# EAGLE schematic schematic (EAGLE 9.6.2)
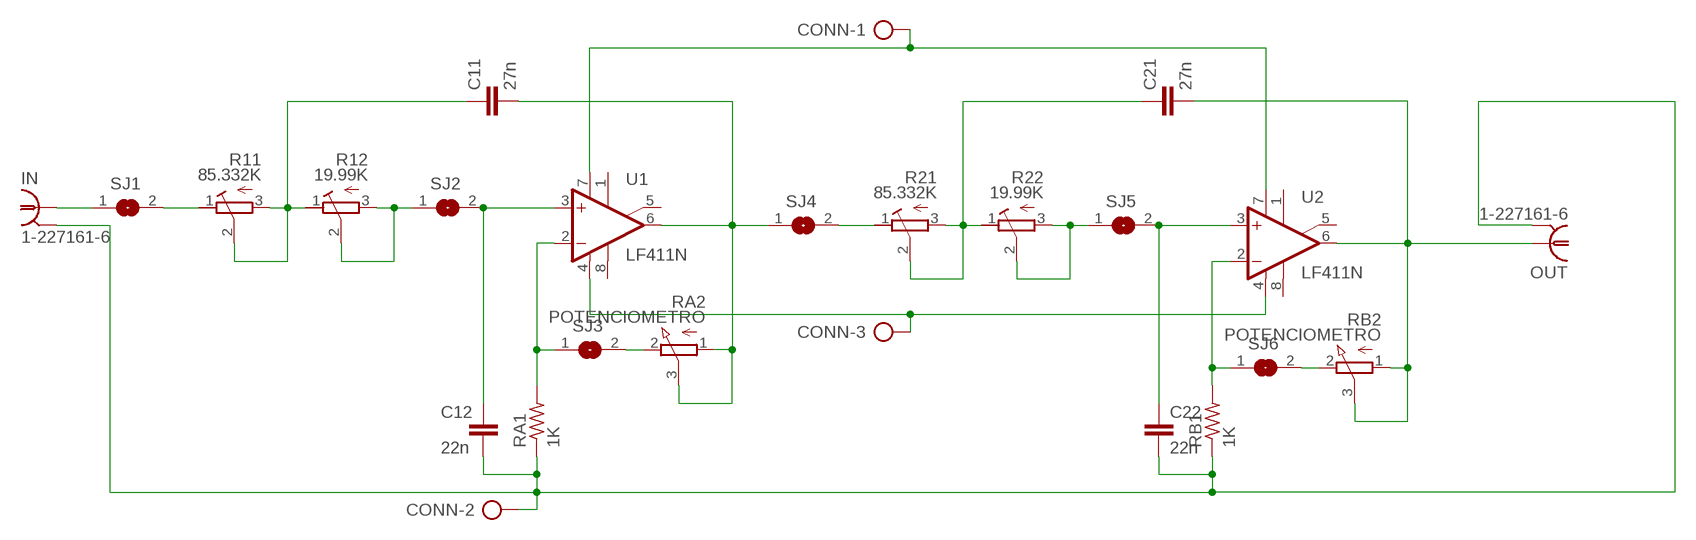
[diagram p0: schematic, sheet 1]

## Parts
C11  27n  C-EU050-025X075  [C050-025X075]
C12  22n  C-EU050-025X075  [C050-025X075]
C21  27n  C-EU050-025X075  [C050-025X075]
C22  22n  C-EU050-025X075  [C050-025X075]
CONN  AK500/3  [AK500/3]
IN  1-227161-6  [AMP_227161]
OUT  1-227161-6  [AMP_227161]
R11  85.332K  R-TRIMMT93YB  [RTRIMT93YB]
R12  19.99K  R-TRIMMT93YB  [RTRIMT93YB]
R21  85.332K  R-TRIMMT93YB  [RTRIMT93YB]
R22  19.99K  R-TRIMMT93YB  [RTRIMT93YB]
RA1  1K  R-US_0207/10  [0207/10]
RA2  POTENCIOMETRO  [TSM4YJ]
RB1  1K  R-US_0207/10  [0207/10]
RB2  POTENCIOMETRO  [TSM4YJ]
SJ1  SJW  [SJW]
SJ2  SJW  [SJW]
SJ3  SJW  [SJW]
SJ4  SJW  [SJW]
SJ5  SJW  [SJW]
SJ6  SJW  [SJW]
U1  LF411N  [DIL08]
U2  LF411N  [DIL08]

## Nets
N$1: IN.1 SJ1.1
N$2: R11.1(E) SJ1.2
N$3: C11.1 R11.2(S) R11.3(A) R12.1(E)
N$4: R12.2(S) R12.3(A) SJ2.1
N$5: C12.1 SJ2.2 U1.3(+IN)
N$6: RA1.2 SJ3.1 U1.2(-IN)
N$7: C12.2 C22.2 CONN.2 IN.2 OUT.2 RA1.1 RB1.1
N$8: C11.2 RA2.1(A) RA2.3(S) SJ4.1 U1.6(OUT)
N$9: R21.1(E) SJ4.2
N$10: RA2.2(E) SJ3.2
N$11: C21.1 R21.2(S) R21.3(A) R22.1(E)
N$12: R22.2(S) R22.3(A) SJ5.1
N$13: C22.1 SJ5.2 U2.3(+IN)
N$14: C21.2 OUT.1 RB2.1(A) RB2.3(S) U2.6(OUT)
N$16: RB1.2 SJ6.1 U2.2(-IN)
N$17: RB2.2(E) SJ6.2
N$18: CONN.1 U1.7(V+) U2.7(V+)
N$19: CONN.3 U1.4(V-) U2.4(V-)
Unconnected: U1.1(ON1) U1.5(ON2) U1.8(OPT) U2.1(ON1) U2.5(ON2) U2.8(OPT)

## Library data of the parts
C11 C12 C21 C22 = rcl:C-EU: CAPACITOR, European symbol; SPICEPREFIX: C
CONN = con-ptr500:AK500/3: CONNECTOR; OC_FARNELL: unknown; OC_NEWARK: unknown
IN OUT = con-coax:?227161*: JACK, RIGHT ANGLE, 50 OHM, PCB, BNC Source: amp_227161.pdf; MF: TYCO ELECTRONICS; MPN: 1-227161-6; OC_FARNELL: unknown; OC_NEWARK: 09H7854
R11 R12 R21 R22 = rcl:R-TRIMM: Trimm resistor; SPICEMODEL: X; SPICEPREFIXL: POT
RA1 RB1 = rcl:R-US_: RESISTOR, American symbol; SPICEPREFIX: R
RA2 RB2 = TSM4_Vishay:POTENCIOMETRO
SJ1-SJ6 = jumper:SJ: SMD solder JUMPER
U1 U2 = linear:LF411: OP AMP